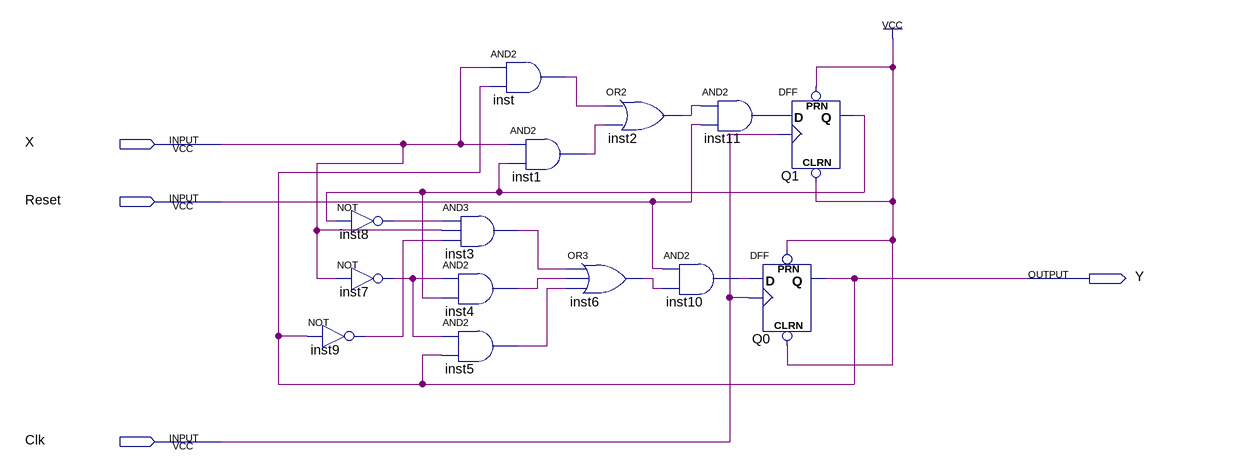
[diagram p0: schematic sheet]
// Quartus schematic SerialNeg.bdf as structural Verilog: 14 symbols, 4 pins
module SerialNeg (
  input  X,
  input  Reset,
  input  Clk,
  output Y
);

  wire inst1_out, inst2_out, inst3_out, inst4_out, inst5_out, inst6_out, inst7_out, inst8_out, inst9_out,
       inst10_out, inst11_out, inst_out, Q1_q;

  not inst8 (inst8_out, Q1_q);
  not inst7 (inst7_out, X);
  not inst9 (inst9_out, Y);
  and inst3 (inst3_out, inst8_out, X, inst9_out);
  and inst4 (inst4_out, inst7_out, Q1_q);
  and inst5 (inst5_out, inst7_out, Y);
  and inst (inst_out, X, Y);
  and inst1 (inst1_out, X, Q1_q);
  or inst6 (inst6_out, inst3_out, inst4_out, inst5_out);
  or inst2 (inst2_out, inst_out, inst1_out);
  and inst10 (inst10_out, Reset, inst6_out);
  and inst11 (inst11_out, inst2_out, Reset);
  DFF Q0 (.CLRN(1'b1), .CLK(Clk), .D(inst10_out), .PRN(1'b1), .Q(Y));
  DFF Q1 (.CLRN(1'b1), .CLK(Clk), .D(inst11_out), .PRN(1'b1), .Q(Q1_q));
endmodule
